# Altium schematic sheet EVB_Gatedriver.SchDoc
size A4; SheetNumber: 1; SheetTotal: 1; SPICEModelCacheOZVHIDVM: <root> / <DocumentId>OZVHIDVM</DocumentId> / </root>
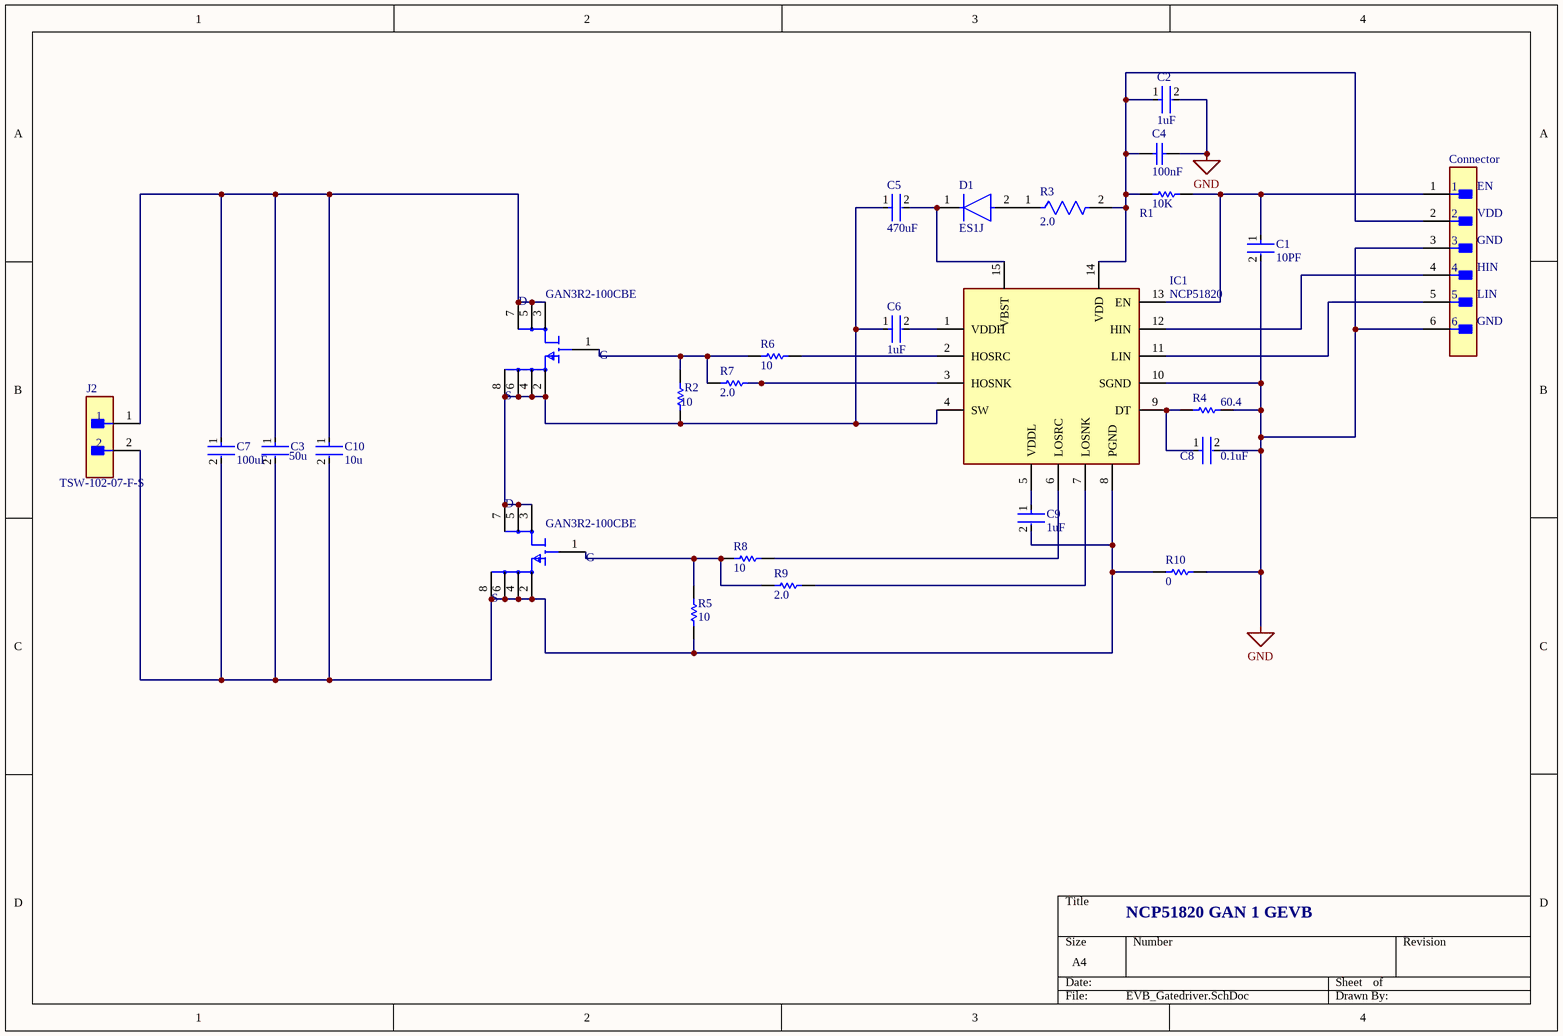
[diagram p0: EVB_Gatedriver.SchDoc]

## Parts
1  GAN3R2-100CBE  [FP-WLCSP8-SOT8072-MFG]
2  GAN3R2-100CBE  [FP-WLCSP8-SOT8072-MFG]
C1  10PF  [FP-C1206C-EB-MFG]
C2  1uF  [FP-CC0805-0_85-MFG]
C3  50u  [FP-CGA5L-0_3-0_1-IPC_B]
C4  100nF  [CAPC2013X145X48LL20T23]
C5  470uF  [FP-C1206C-EB-MFG]
C6  1uF  [FP-1206-L_3_2_0_15-W_1_6-IPC_A]
C7  100uF  [FP-CGA5L-0_3-0_1-IPC_B]
C8  0.1uF  [FP-C1206C-EB-MFG]
C9  1uF  [FP-1206-L_3_2_0_15-W_1_6-IPC_A]
C10  10u  [FP-CGA5L-0_3-0_1-IPC_B]
Connector  (no value)  [FP-22-28-4060-MFG]
D1  ES1J  [FP-403AE-MFG]
IC1  NCP51820  [NCP51820]
J2  TSW-102-07-F-S  [FP-TSW-102-07-F-S-MFG]
R1  10K  [RESC2013X60X35NL10T20]
R2  10  [RESC2013X60X35NL10T20]
R3  2.0  [FP-RMCF1206-IPC_C]
R4  60.4  [RESC3116X65X40LL10T20]
R5  10  [RESC2013X60X35NL10T20]
R6  10  [RESC2013X60X35ML10T20]
R7  2.0  [RESC0201(0603)_M]
R8  10  [RESC2013X60X35ML10T20]
R9  2.0  [RESC0201(0603)_M]
R10  0  [RESC1608X55X25ML10T15]

## Nets
GND: C1.2 C2.2 C4.2 C8.2 Connector.3 Connector.6 IC1.10(SGND) R4.2 R10.2
Net1_1: 1.1(G) R2.2 R6.1 R7.1
Net1_2: 1.2(S) 1.4(S) 1.6(S) 1.8(S) 2.3(D) 2.5(D) 2.7(D) C5.1 C6.1 IC1.4(SW) R2.1
Net1_3: 1.3(D) 1.5(D) 1.7(D) C3.1 C7.1 C10.1 J2.1
Net2_1: 2.1(G) R5.2 R8.1 R9.1
Net2_2: 2.2(S) 2.4(S) 2.6(S) 2.8(S) C3.2 C7.2 C9.2 C10.2 IC1.8(PGND) J2.2 R5.1 R10.1
NetC1_1: C1.1 Connector.1 IC1.13(EN) R1.1
NetC2_1: C2.1 C4.1 Connector.2 IC1.14(VDD) R1.2 R3.2
NetC5_2: C5.2 D1.1(C) IC1.15(VBST)
NetC6_2: C6.2 IC1.1(VDDH)
NetC8_1: C8.1 IC1.9(DT) R4.1
NetC9_1: C9.1 IC1.5(VDDL)
NetConnector_4: Connector.4 IC1.12(HIN)
NetConnector_5: Connector.5 IC1.11(LIN)
NetD1_2: D1.2(A) R3.1
NetIC1_2: IC1.2(HOSRC) R6.2
NetIC1_3: IC1.3(HOSNK) R7.2
NetIC1_6: IC1.6(LOSRC) R8.2
NetIC1_7: IC1.7(LOSNK) R9.2

## Notes on the sheet
- (near Connector) EN
- (near Connector) GND
- (near Connector) VDD
- (near Connector) HIN
- (near Connector) LIN
- NCP51820 GAN 1 GEVB

## Library data of the parts
1 2 = GAN3R2-100CBE_1: GAN3R2-100CBE                                                                                                                                                                                                                                                     100 V, 3.2 mOhm Gallium Nitride (GaN) FET in a 3.5 mm x 2.13 mm Wafer Level Chip; NexarPartId: 136220986; Drain to Source Resistance: 2.4mΩ; Power Dissipation: 394W; Number of Channels: 1; Drain to Source Voltage (Vdss): 100V; Gate to Source Voltage (Vgs): -4V; Max Junction Temperature (Tj): 150°C; Continuous Drain Current (ID): 60A; Height: 464µm; Max Operating Temperature: 150°C; Min Operating Temperature: -40°C; Drain to Source Breakdown Voltage: 100V; MPN: GAN3R2-100CBE
C1 = CMP-1037-00647-2: CAP CER 10PF 50V C0G/NP0 1206; Manufacturer Part Number: C1206C100J5GACTU; Manufacturer: KEMET; Temperature Characteristic: C0G; Material: Ceramic; Temperature Coefficient: 15%; Automotive Grade: Grade 0; Tolerance: 0.05; Automotive: Yes; Value: 10 pF; Capacitance: 10 pF; Temperature Range High: +150°C; Device Class L2: Capacitors; Octopart: https://octopart.com/c1206c100j5gactu-kemet-87062; Height: 0.88mm; ComponentLink2Description: Datasheet; Package: C1206C-EB; Voltage Rating: 50 V; RoHS: TRUE; Device Class L1: Passive Components; Temperature Range Low: -55°C; Lead Free: Yes; Device Class L3: Ceramic Capacitors; ComponentLink2URL: https://content.kemet.com/datasheets/KEM_C1007_X8R_ULTRA_150C_SMD.pdf; Digikey Description: CAP CER 10PF 50V C0G/NP0 1206; Category: Cap; Ipc Land Pattern Name: CAPC320160X78; Mouser Description: Multilayer Ceramic Capacitors MLCC - SMD/SMT 50volts 10pF C0G 5%; Temperature: -55°C to +150°C
C2 = CMP-03422-000001-1: CAP CER 1UF 16V X7R 0805; Manufacturer: Yageo; Manufacturer Part Number: CC0805KKX7R7BB105; Description: CC0805 1 uF X7R 10.00% 16 V; Material: Ceramic; Tolerance: 0.1; Voltage Rating: 16 V; Category: Cap; Capacitance: 1 uF; ComponentLink2Description: Datasheet; Automotive: No; Temperature Range High: +85°C; RoHS: TRUE; Footprint Url: http://www.yageo.com/exep/pages/download/literatures/UPY-C_GEN_24.pdf; Mouser Description: Multilayer Ceramic Capacitors MLCC - SMD/SMT 1.0uF 16V X7R 10%; Height: 0.95mm; Ipc Land Pattern Name: CAPC200125X85; Temperature: -30°C to +85°C; Lead Free: Yes; Value: 1 uF; Temperature Characteristic: X7R; Package: CC0805-0.85; Temperature Range Low: -30°C; Device Class L1: Passive Components; Device Class L3: Ceramic Capacitors; Octopart: https://octopart.com/cc0805kkx7r7bb105-yageo-8376555; ComponentLink2URL: http://www.yageo.com/documents/recent/UPY-GPHC_Y5V_6.3V-to-50V_8.pdf; Device Class L2: Capacitors; Digikey Description: CAP CER 1UF 16V X7R 0805
C3 C7 C10 = CMP-08246-001673-1: Cap Ceramic 100nF 450V X7T 10% Pad SMD 1206 +125°C Automotive T/R; Min Operating Temperature: -55°C; Weight: 0.000571oz; Mount: Surface Mount; Depth: 1.6mm; Tolerance: 10%; Height: 1.6mm; Packaging: Tape and Reel; Ratings: AEC-Q200; Width: 0.063inch; Case Code (Imperial): 1206; Lead Free: Lead Free; Capacitance: 100nF; Termination: SMD/SMT; Features: Soft Termination; Thickness: 0.075inch; Package Quantity: 1; Case/Package: 1206; Length: 3.2mm; Max Operating Temperature: 125°C; Dielectric: X7T; REACH SVHC: No SVHC; Case Code (Metric): 3216; Voltage Rating: 450V; Voltage Rating (DC): 450V
C4 = CMP-2007-03166-1: Manufacturer: Vitramon; Part Number: VJ0805Y104JXXAT
C5 = CMP-1037-04557-2: CAP CER 0.47UF 25V X5R 1206; Manufacturer: KEMET; Manufacturer Part Number: C1206C474K3PACTU; Capacitance: 0.47 μF; Value: 0.47 μF; Material: Ceramic; Automotive Grade: Grade 0; Temperature Coefficient: 15%; Tolerance: 0.1; ComponentLink2URL: https://content.kemet.com/datasheets/KEM_C1007_X8R_ULTRA_150C_SMD.pdf; Digikey Description: CAP CER 0.47UF 25V X5R 1206; Device Class L2: Capacitors; Temperature Range Low: -55°C; ComponentLink2Description: Datasheet; Mouser Description: Multilayer Ceramic Capacitors MLCC - SMD/SMT 25volts 0.47uF X5R 10%; Automotive: Yes; Temperature Range High: +150°C; Ipc Land Pattern Name: CAPC320160X78; Temperature Characteristic: X5R; Voltage Rating: 25 V; Device Class L3: Ceramic Capacitors; Octopart: https://octopart.com/c1206c474k3pactu-kemet-16430430; Lead Free: Yes; Temperature: -55°C to +150°C; Category: Cap; Device Class L1: Passive Components; RoHS: TRUE; Package: C1206C-EB; Height: 0.88mm
C6 C9 = CMP-14477-003409-2: None; Tolerance: 10%; Voltage: 25V; Dielectric: X5R; Termination: SMD/SMT; Case/Package: 1206; Min Operating Temperature: -55°C; Height: 0.85mm; Construction: Flat; Packaging: Tape and Reel; Package Quantity: 1; RoHS Compliant: Yes; Capacitance: 1uF; Lead Free: Lead Free; Radiation Hardening: No; Halogen Free: Halogen Free; Length: 3.2mm; Max Operating Temperature: 85°C; Resistor Type: Ceramic; Voltage Rating: 25V; Number of Pins: 2; Case Code (Imperial): 1206; Voltage Rating (DC): 25V; Thickness: 0.037inch; Case Code (Metric): 3216; Depth: 1.6mm; Width: 0.063inch; Mount: Surface Mount; Series: M
C8 = CMP-03020-001014-1: CAP CER 0.1UF 25V 10% X7R 1206; Manufacturer: KEMET; Manufacturer Part Number: C1206C104K3RACTU; Temperature Coefficient: 15%; Material: Ceramic; Capacitance: 0.10 μF; Value: 0.10 μF; Automotive Grade: Grade 0; Tolerance: 0.1; Mouser Description: CAP CER 0.1UF 25V X7R 1206; Category: Cap; Lead Free: Yes; Automotive: Yes; Temperature Range Low: -55°C; Package: C1206C-EB; RoHS: TRUE; ComponentLink2URL: https://content.kemet.com/datasheets/KEM_C1007_X8R_ULTRA_150C_SMD.pdf; Temperature Range High: +150°C; Octopart: https://octopart.com/c1206c104k3ractu-kemet-9144317; Digikey Description: CAP CER 0.1UF 25V 10% X7R 1206; Device Class L3: Ceramic Capacitors; Temperature Characteristic: X7R; Voltage Rating: 25 V; Ipc Land Pattern Name: CAPC320160X78; Height: 0.88mm; ComponentLink2Description: Datasheet; Device Class L1: Passive Components; Temperature: -55°C to +150°C; Device Class L2: Capacitors
Connector = CMP-04776-000763-1: CONN HEADER VERT 6POS 2.54MM; Voltage Rating: 250V; Current Rating: 4A; Number of Contacts: 6; Max Voltage Rating (DC): 250.25kV; Gender: Male; Contact Resistance: 20mR; Connector Type: Male Pin; Color: Black; Max Voltage Rating (AC): 250V; Pitch: 2.54mm; Orientation: Straight; Max Operating Temperature: 75°C; Contact Plating: Tin; Depth: 2.49mm; Contact Type: Male Pin; Number of Positions: 6; Length: 15.24mm; Packaging: Bulk; Mount: Through Hole; Housing Material: Thermoplastic; Housing Color: Black; Termination: Solder; Contact Material: Brass; Min Operating Temperature: 0°C; Series: KK® 42375; Number of Rows: 1; Package Quantity: 1; RoHS Compliant: Yes; Contact Mating Length: 0.24inch; MPN: 22-28-4060
D1 = CMP-07163-000025-1: DIODE GEN PURP 400V 1A SMA; Manufacturer: ON Semiconductor; Manufacturer Part Number: ES1G; Capacitance: 10pF; Peak Reverse Current: 5uA; Standoff Height: 0.05mm; Value: 10pF; Max Junction Temp: +150°C; Max Surge Forward Current: 30A; Mouser Description: Rectifiers 1.0 A Ultra Fast Recovery Rect; Digikey Description: DIODE GEN PURP 400V 1A SMA; Device Class L1: Discrete Semiconductors; Automotive: No; Octopart: https://octopart.com/es1g-on+semiconductor-84324858; Height: 2.5mm; Temperature: to +150°C; RoHS: TRUE; Footprint Url: https://www.onsemi.com/pub/Collateral/403AE.PDF; Temperature Range High: +150°C; Category: Diode; Lead Free: Yes; Max Repetitive Reverse Voltage: 400V; Package: 403AE; ComponentLink2Description: Datasheet; Forward Current: 1A; ComponentLink2URL: https://www.onsemi.com/pub/Collateral/ES1J-D.PDF; Device Class L3: Rectifier Diodes; Device Class L2: Diodes; MPN: ES1J
IC1 = NCP51820: Integrated Circuit; Manufacturer_Name: onsemi; Datasheet Link: https://www.onsemi.com/download/data-sheet/pdf/ncp51820-d.pdf; Height: 0.9mm; Manufacturer_Part_Number: NCP51820; Mouser Part Number: N/A; Mouser Price/Stock: https://www.mouser.co.uk/ProductDetail/onsemi/NCP51820?qs=vEM7xhTegWhaPMdkL3AwCA%3D%3D; MPN: NCP51820
J2 = CMP-02766-001458-1: CONN HEADER VERT 2POS 2.54MM; Gender: Male; Max Current Rating: 7.6A; Number of Contacts: 2; Max Voltage Rating (AC): 550V; Orientation: Straight; Depth: 2.54mm; Series: TSW; Package Quantity: 1; Min Operating Temperature: -55°C; Max Operating Temperature: 125°C; Contact Type: Male Pin; Contact Shape: Square; Color: Black; Housing Color: Black; Connector Type: Header; Fastening Type: Pull; Radiation Hardening: No; Pitch: 2.54mm; Housing Material: Polyester; Mount: Through Hole; Number of Positions: 2; Number of Rows: 1; Contact Material: Bronze; Insulation Color: Black; Contact Finish - Mating: GOLD; Termination: Solder; Insulation Material: PBT; Length: 5.08mm; Flammability Rating: UL94 V-0; Contact Mating Length: 0.23inch; REACH SVHC: No SVHC; Contact Plating: Gold; RoHS Compliant: Yes; Packaging: Bulk
R1 R2 R5 = CMP-1659-00013-4: Chip Resistor, 10 KOhm, +/- 1%, 0.125 W, -55 to 155 degC, 0805 (2012 Metric), RoHS, Tape and Reel; Manufacturer: Yageo; Voltage Rating: 150 V; Mount: Surface Mount; ComponentLink1Description: Manufacturer URL; ComponentLink2URL: http://www.yageo.com/documents/recent/PYu-RC_Group_51_RoHS_L_04.pdf; Pins: 2; Length: 2 mm; Min Operating Temperature: -55 degC; Height: 0.5 mm; Mounting Technology: Surface Mount; RoHSCompliant: true; REACH SVHC: No SVHC; ComponentLink1URL: http://www.yageo.com/; Max Operating Temperature: 155 degC; PackageReference: 0805; DatasheetVersion: Rev. 4, 02/2016; Package Quantity: 5000; Packaging: Tape and Reel; ComponentLink2Description: Datasheet; PackageDescription: 2-Pin Surface Mounted Device, Body 2 x 1.25 mm
R3 = CMP-26527-002749-1: RES 2 OHM 1% 1/4W 1206; Resistance: 2R; Temperature Coefficient: 200ppm/°C; Max Power Dissipation: 250mW; Width: 0.063inch; Max Operating Temperature: 155°C; Min Operating Temperature: -55°C; Package Quantity: 5000; Packaging: Tape and Reel; Number of Terminations: 2; Features: Automotive AEC-Q200; Tolerance: 1%; Series: RMCF; Case Code (Imperial): 1206; Contact Plating: Tin; RoHS Compliant: Yes; Lead Free: Lead Free; Height: 0.028inch; Mount: Surface Mount; Resistor Type: Thick Film; Case/Package: 1206; Case Code (Metric): 3216; Radiation Hardening: No; Length: 0.126inch
R4 = CMP-2003-03498-1: Part Number: RC1206FR-1360R4L; Manufacturer: Yageo
R6 R8 = CMP-2100-03670-1: Chip Resistor, 10 Ohm, +/- 1%, 0.125 W, -55 to 155 degC, 0805 (2012 Metric), RoHS, Tape and Reel; Manufacturer: Yageo; Resistance: 10Ohm; Power Rating: 125mW; Voltage Rating: 150V; Temperature Coefficient: 200ppm/degreesC; Number of Pins: 2; REACH SVHC: NoSVHC; Datasheet Version: Rev. 5, 10/2016; Max Operating Temperature: 155degC; Manufacturer URL: http://www.yageo.com/; Case Code (Imperial): 0805; Package Description: 2-Pin Surface Mounted Device, Body 2 x 1.25 mm; Case Code (Metric): 2012; Length: 2mm; RoHSCompliant: true; Max Power Dissipation: 125mW; Depth: 1.25mm; Packaging: TapeandReel; Height: 0.5mm; Package Reference: 0805; Package Quantity: 1; Tolerance: 1%; Termination: SMD/SMT; Min Operating Temperature: -55degC; Lead Free: LeadFree; Width: 1.25mm; Voltage Rating (DC): 150V; Datasheet URL: http://www.yageo.com/NewPortal/yageodocoutput?fileName=/pdf/R-Chip/PYu-RC_Group_51_RoHS_L_5.pdf; Composition: ThickFilm; Number of Terminations: 2; Case/Package: 0805
R7 R9 = CMP-1010-00009-1: 2R 0.05W 5% 0201 (0603 Metric)  SMD; Case-EIA: 0201; Value: 2.00 Ohm; Case-Metric: 0603; Power: 0.05 W; Technology: SMT; Tolerance: 5 %
R10 = CMP-2100-03667-1: Chip Resistor, 0 Ohm, +/- 5%, 0.1 W, -55 to 155 degC, 0603 (1608 Metric), RoHS, Tape and Reel; Manufacturer: Yageo; MPN: RC0603JR−070RL; Temperature Coefficient: 200ppm/degreesC; Voltage Rating: 50V; Power Rating: 100mW; Resistance: 0mOhm; Width: 0.8mm; Max Operating Temperature: 155degC; Tolerance: 5%; Package Reference: 0603; Height: 0.45mm; Depth: 0.8mm; Package Description: 2-Pin Surface Mount Device, Body 1.6 x 0.8 mm; Termination: SMD/SMT; Package Quantity: 5000; Case/Package: 0603; Case Code (Imperial): 0603; Radiation Hardening: No; Number of Pins: 2; Length: 1.6mm; Lead Free: LeadFree; Voltage Rating (DC): 50V; Military Standard: Not; Datasheet URL: http://www.yageo.com/NewPortal/yageodocoutput?fileName=/pdf/R-Chip/PYu-RC_Group_51_RoHS_L_5.pdf; Manufacturer URL: http://www.yageo.com/; Packaging: TapeandReel; Case Code (Metric): 1608; Min Operating Temperature: -55degC; Composition: ThickFilm; RoHSCompliant: true; Contact Plating: Tin; Datasheet Version: Rev. 5, 10/2016; REACH SVHC: NoSVHC